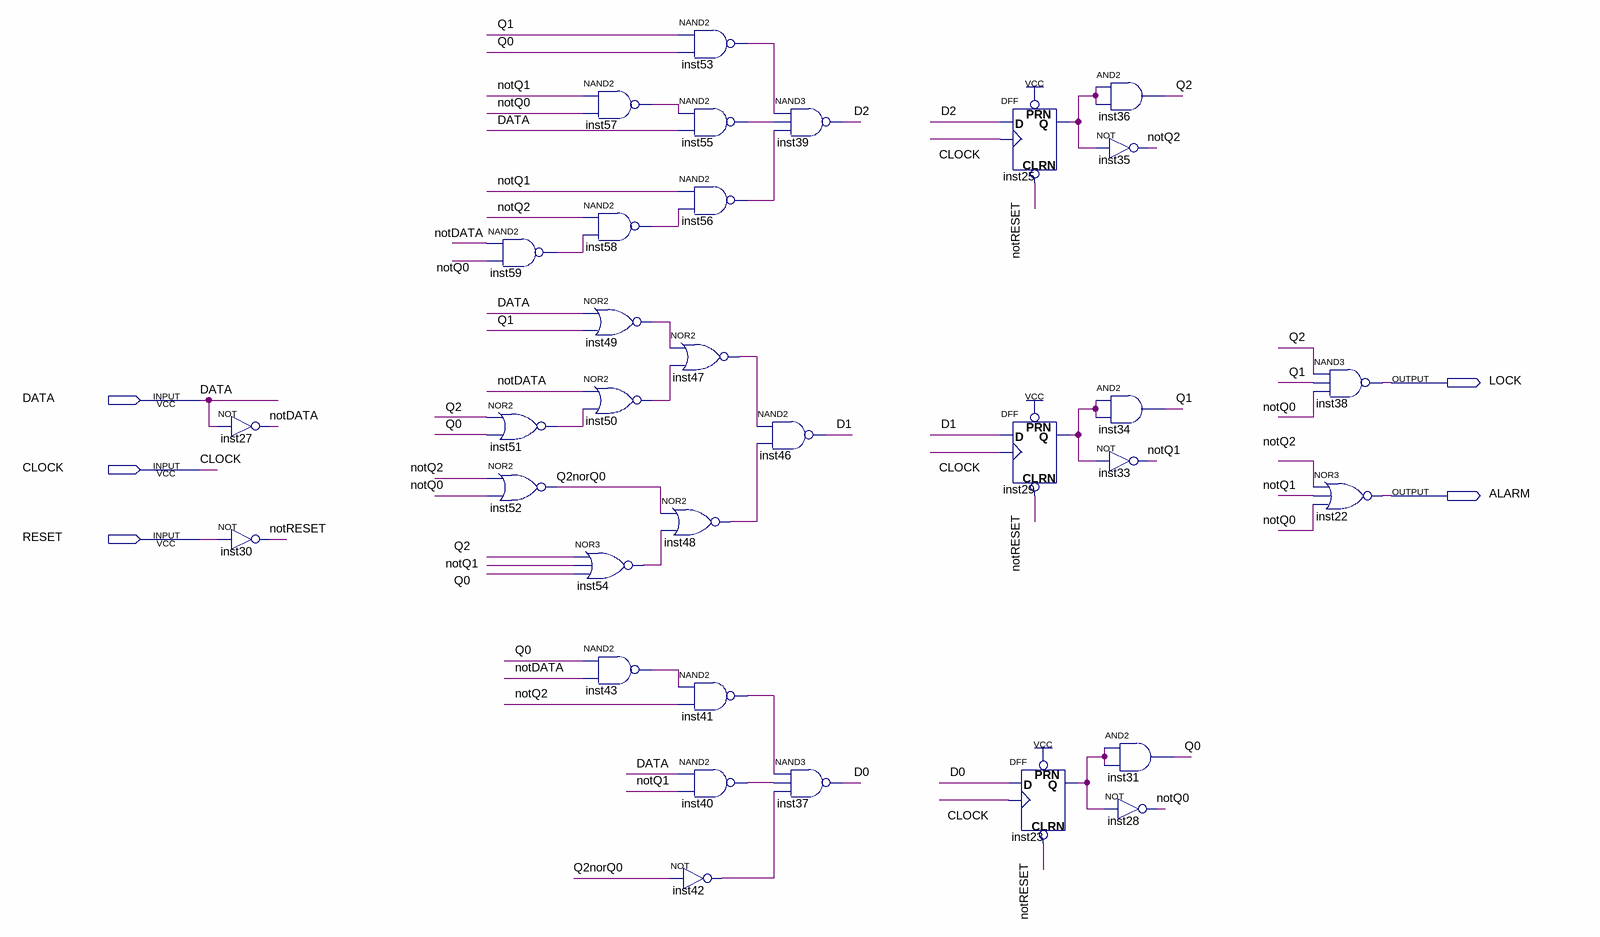
[diagram p0: schematic sheet]
// Quartus schematic dlock.bdf as structural Verilog: 33 symbols, 5 pins
module dlock (
  input  DATA,
  input  CLOCK,
  input  RESET,
  output LOCK,
  output ALARM
);

  wire D0, D1, D2, inst23_q, inst25_q, inst29_q, inst40_out, inst41_out, inst42_out, inst43_out, inst47_out,
       inst48_out, inst49_out, inst50_out, inst51_out, inst53_out, inst54_out, inst55_out, inst56_out,
       inst57_out, inst58_out, inst59_out, notDATA, notQ0, notQ1, notQ2, notRESET, Q0, Q1, Q2, Q2norQ0;

  not inst27 (notDATA, DATA);
  not inst30 (notRESET, RESET);
  nand inst59 (inst59_out, notDATA, notQ0);
  nor inst51 (inst51_out, Q2, Q0);
  nor inst52 (Q2norQ0, notQ2, notQ0);
  nand inst57 (inst57_out, notQ1, notQ0);
  nand inst58 (inst58_out, notQ2, inst59_out);
  nor inst49 (inst49_out, DATA, Q1);
  nor inst50 (inst50_out, notDATA, inst51_out);
  nor inst54 (inst54_out, Q2, notQ1, Q0);
  nand inst43 (inst43_out, Q0, notDATA);
  nand inst53 (inst53_out, Q1, Q0);
  nand inst55 (inst55_out, inst57_out, DATA);
  nand inst56 (inst56_out, notQ1, inst58_out);
  nor inst47 (inst47_out, inst49_out, inst50_out);
  nor inst48 (inst48_out, Q2norQ0, inst54_out);
  nand inst41 (inst41_out, inst43_out, notQ2);
  nand inst40 (inst40_out, DATA, notQ1);
  not inst42 (inst42_out, Q2norQ0);
  nand inst39 (D2, inst53_out, inst55_out, inst56_out);
  nand inst46 (D1, inst47_out, inst48_out);
  nand inst37 (D0, inst41_out, inst40_out, inst42_out);
  DFF inst25 (.CLRN(notRESET), .CLK(CLOCK), .D(D2), .PRN(1'b1), .Q(inst25_q));
  DFF inst29 (.CLRN(notRESET), .CLK(CLOCK), .D(D1), .PRN(1'b1), .Q(inst29_q));
  DFF inst23 (.CLRN(notRESET), .CLK(CLOCK), .D(D0), .PRN(1'b1), .Q(inst23_q));
  and inst36 (Q2, inst25_q, inst25_q);
  not inst35 (notQ2, inst25_q);
  and inst34 (Q1, inst29_q, inst29_q);
  not inst33 (notQ1, inst29_q);
  and inst31 (Q0, inst23_q, inst23_q);
  not inst28 (notQ0, inst23_q);
  nand inst38 (LOCK, Q2, Q1, notQ0);
  nor inst22 (ALARM, notQ2, notQ1, notQ0);
endmodule
